# Altium schematic sheet Main.SchDoc
size A
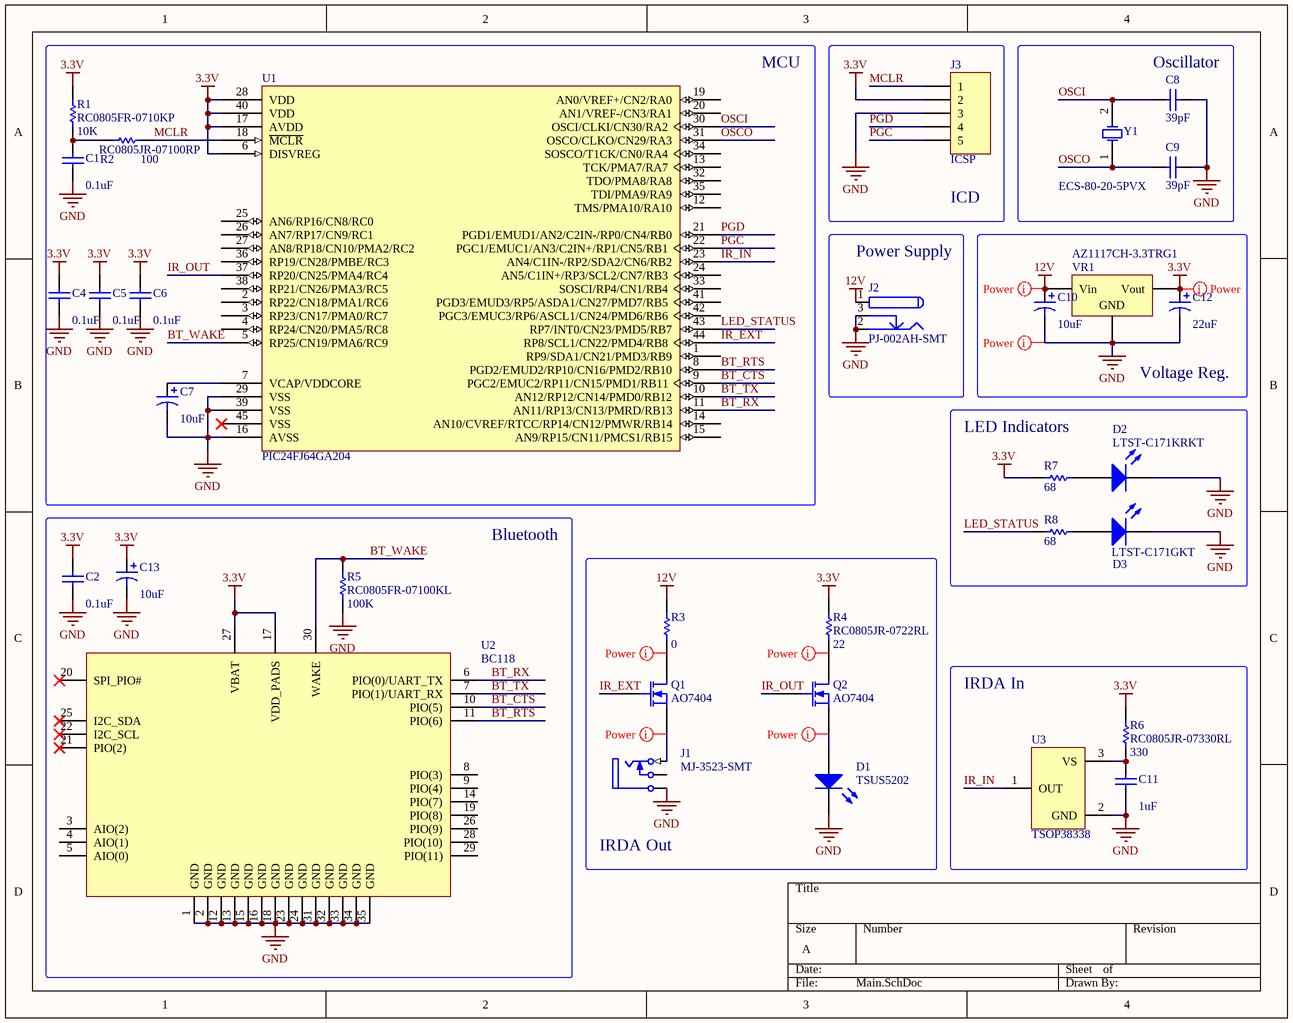
[diagram p0: Main.SchDoc]

## Parts
C1  value 0.1uF  [C0805]  (hidden comment: C0805C104K8RACTU)
C2  value 0.1uF  [C0805]  (hidden comment: C0805C104K8RACTU)
C4  value 0.1uF  [C0805]  (hidden comment: C0805C104K8RACTU)
C5  value 0.1uF  [C0805]  (hidden comment: C0805C104K8RACTU)
C6  value 0.1uF  [C0805]  (hidden comment: C0805C104K8RACTU)
C7  value 10uF  [C0805]  (hidden comment: C0805C106K4PACTU)
C8  value 39pF  [C0805]  (hidden comment: C0805C390J5GACTU)
C9  value 39pF  [C0805]  (hidden comment: C0805C390J5GACTU)
C10  value 10uF  [C0805]  (hidden comment: C0805C106K4PACTU)
C11  value 1uF  [C0805]  (hidden comment: C0805C105K8RACTU)
C12  value 22uF  [C0805]  (hidden comment: C2012X5R1C226K125AC)
C13  value 10uF  [C0805]  (hidden comment: C0805C106K4PACTU)
D1  TSUS5202  [RADIAL-2.54]
D2  LTST-C171KRKT  [6-0805_M]
D3  LTST-C171GKT  [6-0805_M]
J1  MJ-3523-SMT  [MJ-3523]
J2  PJ-002AH-SMT  [PJ-002AH-SMT]
J3  ICSP  [TC2030-MCP-NL]
Q1  AO7404  [SOT323-M]
Q2  AO7404  [SOT323-M]
R1  RC0805FR-0710KP  value 10K  [6-0805_M]
R2  RC0805JR-07100RP  value 100  [6-0805_M]
R3  value 0  [6-0805_M]  (hidden comment: DNP)
R4  RC0805JR-0722RL  value 22  [6-0805_M]
R5  RC0805FR-07100KL  value 100K  [6-0805_M]
R6  RC0805JR-07330RL  value 330  [6-0805_M]
R7  value 68  [6-0805_M]  (hidden comment: RC0805JR-0768RL)
R8  value 68  [6-0805_M]  (hidden comment: RC0805JR-0768RL)
U1  PIC24FJ64GA204  [QFN44_PIC]
U2  BC118  [BC118]
U3  TSOP38338  [TSOP]
VR1  AZ1117CH-3.3TRG1  [SOT223_M]
Y1  ECS-80-20-5PVX  [HC49/US]

## Blocks framed on the sheet
MCU: C1 C4-C7 R1 R2 U1
ICD: J3
Oscillator: C8 C9 Y1
Power Supply: J2
Voltage Reg.: C10 C12 VR1
LED Indicators: D2 D3 R7 R8
Bluetooth: C2 C13 R5 U2
IRDA Out: D1 J1 Q1 Q2 R3 R4
IRDA In: C11 R6 U3

## Nets
3.3V: C2.2 C4.2 C5.2 C6.2 C12.1 C13.1 J3.2 R1.2 R4.2 R6.1 R7.2 U1.6(DISVREG) U1.17(AVDD) U1.28(VDD) U1.40(VDD) U2.17(VDD_PADS) U2.27(VBAT) VR1.3(Vout)
12V: C10.1 J2.1 R3.2 VR1.1(Vin)
GND: C1.1 C2.1 C4.1 C5.1 C6.1 C7.2 C8.2 C9.2 C10.2 C11.1 C12.2 C13.2 D1.2(K) D2.2(K) D3.2(K) J1.5(S) J2.2 J2.3 J3.3 R5.2 U1.16(AVSS) U1.29(VSS) U1.39(VSS) U2.1(GND) U2.2(GND) U2.12(GND) U2.13(GND) U2.15(GND) U2.16(GND) U2.18(GND) U2.23(GND) U2.24(GND) U2.31(GND) U2.32(GND) U2.33(GND) U2.34(GND) U2.35(GND) U3.2(GND) VR1.2(GND)
BT_CTS: U1.9(PGC2/EMUC2/RP11/CN15/PMD1/RB11) U2.10(PIO(5))
BT_RTS: U1.8(PGD2/EMUD2/RP10/CN16/PMD2/RB10) U2.11(PIO(6))
BT_RX: U1.11(AN11/RP13/CN13/PMRD/RB13) U2.6(PIO(0)/UART_TX)
BT_TX: U1.10(AN12/RP12/CN14/PMD0/RB12) U2.7(PIO(1)/UART_RX)
BT_WAKE: R5.1 U1.5(RP25/CN19/PMA6/RC9) U2.30(WAKE)
IR_EXT: Q1.2(G) U1.44(RP8/SCL1/CN22/PMD4/RB8)
IR_IN: U1.23(AN4/C1IN-/RP2/SDA2/CN6/RB2) U3.1(OUT)
IR_OUT: Q2.2(G) U1.37(RP20/CN25/PMA4/RC4)
LED_STATUS: R8.2 U1.43(RP7/INT0/CN23/PMD5/RB7)
MCLR: J3.1 R2.2 U1.18(~{MCLR})
OSCI: C8.1 U1.30(OSCI/CLKI/CN30/RA2) Y1.2(OSC2)
OSCO: C9.1 U1.31(OSCO/CLKO/CN29/RA3) Y1.1(OSC1)
PGC: J3.5 U1.22(PGC1/EMUC1/AN3/C2IN+/RP1/CN5/RB1)
PGD: J3.4 U1.21(PGD1/EMUD1/AN2/C2IN-/RP0/CN4/RB0)
NetC1_2: C1.2 R1.1 R2.1
NetC7_1: C7.1 U1.7(VCAP/VDDCORE)
NetC11_2: C11.2 R6.2 U3.3(VS)
NetD1_1: D1.1(A) Q2.3(S)
NetD2_1: D2.1(A) R7.1
NetD3_1: D3.1(A) R8.1
NetJ1_1: J1.1(T) Q1.3(S)
NetQ1_1: Q1.1(D) R3.1
NetQ2_1: Q2.1(D) R4.1

Not connected (* = marked no-connect by the designer): J1 2(TN); U1 1(RP9/SDA1/CN21/PMD3/RB9) 2(RP22/CN18/PMA1/RC6) 3(RP23/CN17/PMA0/RC7) 4(RP24/CN20/PMA5/RC8) 12(TMS/PMA10/RA10) 13(TCK/PMA7/RA7) 14(AN10/CVREF/RTCC/RP14/CN12/PMWR/RB14) 15(AN9/RP15/CN11/PMCS1/RB15) 19(AN0/VREF+/CN2/RA0) 20(AN1/VREF-/CN3/RA1) 24(AN5/C1IN+/RP3/SCL2/CN7/RB3) 25(AN6/RP16/CN8/RC0) 26(AN7/RP17/CN9/RC1) 27(AN8/RP18/CN10/PMA2/RC2) 32(TDO/PMA8/RA8) 33(SOSCI/RP4/CN1/RB4) 34(SOSCO/T1CK/CN0/RA4) 35(TDI/PMA9/RA9) 36(RP19/CN28/PMBE/RC3) 38(RP21/CN26/PMA3/RC5) 41(PGD3/EMUD3/RP5/ASDA1/CN27/PMD7/RB5) 42(PGC3/EMUC3/RP6/ASCL1/CN24/PMD6/RB6) 45(VSS)*; U2 3(AIO(2)) 4(AIO(1)) 5(AIO(0)) 8(PIO(3)) 9(PIO(4)) 14(PIO(7)) 19(PIO(8)) 20(SPI_PIO#)* 21(PIO(2))* 22(I2C_SCL)* 25(I2C_SDA)* 26(PIO(9)) 28(PIO(10)) 29(PIO(11))

## Layout directives
net class Power: 3.3V, 12V, GND, NetD1_1, NetJ1_1, NetQ1_1, NetQ2_1

## Library data of the parts
C1 C2 C4-C6 = Cap Semi: CAP CER 0.1UF 10V 10% X7R 0805; Published: 8-Jun-2000; LatestRevisionDate: 29-May-2009; LatestRevisionNote: IPC-7351 Footprint Added.; PackageReference: C1206; Publisher: Altium Limited; PackageDescription: Chip Capacitor
C7 C10 C13 = Cap Pol3: CAP CER 10UF 16V 10% X5R 0805; Published: 8-Jun-2000; LatestRevisionDate: 29-May-2009; LatestRevisionNote: IPC-7351 Footprint Added.; PackageReference: C0805; Publisher: Altium Limited; PackageDescription: Chip Capacitor
C8 C9 = Cap Semi: CAP CER 39PF 50V 5% NP0 0805; Published: 8-Jun-2000; LatestRevisionDate: 29-May-2009; LatestRevisionNote: IPC-7351 Footprint Added.; PackageReference: C1206; Publisher: Altium Limited; PackageDescription: Chip Capacitor
C11 = Cap Semi: CAP CER 1UF 10V 10% X7R 080; Published: 8-Jun-2000; LatestRevisionDate: 29-May-2009; LatestRevisionNote: IPC-7351 Footprint Added.; PackageReference: C1206; Publisher: Altium Limited; PackageDescription: Chip Capacitor
C12 = Cap Pol3: CAP CER 22UF 16V 10% X5R 0805; Published: 8-Jun-2000; LatestRevisionDate: 29-May-2009; LatestRevisionNote: IPC-7351 Footprint Added.; PackageReference: C0805; Publisher: Altium Limited; PackageDescription: Chip Capacitor
D1 = LED0: EMITTER IR 950NM 150MA RADIAL; Published: 8-Jun-2000; LatestRevisionDate: 08-Jul-2005; LatestRevisionNote: Mech Layer 1 removed.; PackageReference: LED-0; Publisher: Altium Limited; PackageDescription: LED; 2 Leads
D2 = LED2: LED RED CLEAR THIN 0805 SMD; Published: 8-Jun-2000; LatestRevisionDate: 17-Jul-2002; LatestRevisionNote: Re-released for DXP Platform.; PackageVersion: Feb-2002; PackageReference: 3.2X1.6X1.1; Publisher: Altium Limited; PackageDescription: SM LED; 2 Flat Leads
D3 = LED2: LED GREEN CLEAR THIN 0805 SMD; Published: 8-Jun-2000; LatestRevisionDate: 17-Jul-2002; LatestRevisionNote: Re-released for DXP Platform.; PackageVersion: Feb-2002; PackageReference: 3.2X1.6X1.1; Publisher: Altium Limited; PackageDescription: SM LED; 2 Flat Leads
J1 = Phonejack2 TN: CONN AUDIO JACK MONO 3.5MM SMD; pin to pad: 1>2 2>10 5>1; PackageDocument: 2003; PCB_Layout: Complies with manufacturer's recommendation.; DrillAndSlotSize: Corresponds to nominal value.; LatestRevisionDate: 15-Jul-2004; LatestRevisionNote: Component Replaced & renamed from "Phonejack".; DatasheetDocument: 2003; PackageReference: S1VS_SNB; Publisher: Altium Limited; ComponentLink1Description: Manufacturer Link; ComponentLink1URL: http://www.cliffuk.co.uk/
J2 = PJ-002AH-SMT: Low Voltage Power Supply Connector
Q1 Q2 = MOSFET-N: N-Channel MOSFET; Published: 8-Jun-2000; LatestRevisionDate: 17-Jul-2002; LatestRevisionNote: Re-released for DXP Platform.; PackageVersion: 1995/1996; PackageReference: E3; Publisher: Altium Limited; PackageDescription: TO, Flat Index; 3 In-Line, Axial Leads; Body Dia. 4.6mm; Lead Dia. 0.5 mm (max)
R1 = Res1: RES SMD 10K OHM 5% 1/8W 0805; Published: 8-Jun-2000; LatestRevisionDate: 17-Jul-2002; LatestRevisionNote: Re-released for DXP Platform.; PackageReference: AXIAL-0.3; Publisher: Altium Limited; PackageDescription: Axial Device, Thru-Hole; 2 Leads; 0.3 in Pin Spacing
R2 = Res1: RES SMD 100 OHM 5% 1/8W 0805; Published: 8-Jun-2000; LatestRevisionDate: 17-Jul-2002; LatestRevisionNote: Re-released for DXP Platform.; PackageReference: AXIAL-0.3; Publisher: Altium Limited; PackageDescription: Axial Device, Thru-Hole; 2 Leads; 0.3 in Pin Spacing
R3 = Res1: Published: 8-Jun-2000; LatestRevisionDate: 17-Jul-2002; LatestRevisionNote: Re-released for DXP Platform.; PackageReference: AXIAL-0.3; Publisher: Altium Limited; PackageDescription: Axial Device, Thru-Hole; 2 Leads; 0.3 in Pin Spacing
R4 = Res1: RES SMD 22 OHM 5% 1/8W 0805; Published: 8-Jun-2000; LatestRevisionDate: 17-Jul-2002; LatestRevisionNote: Re-released for DXP Platform.; PackageReference: AXIAL-0.3; Publisher: Altium Limited; PackageDescription: Axial Device, Thru-Hole; 2 Leads; 0.3 in Pin Spacing
R5 = Res1: RES SMD 100K OHM 1% 1/8W 0805; Published: 8-Jun-2000; LatestRevisionDate: 17-Jul-2002; LatestRevisionNote: Re-released for DXP Platform.; PackageReference: AXIAL-0.3; Publisher: Altium Limited; PackageDescription: Axial Device, Thru-Hole; 2 Leads; 0.3 in Pin Spacing
R6 = Res1: RES SMD 330 OHM 5% 1/8W 0805; Published: 8-Jun-2000; LatestRevisionDate: 17-Jul-2002; LatestRevisionNote: Re-released for DXP Platform.; PackageReference: AXIAL-0.3; Publisher: Altium Limited; PackageDescription: Axial Device, Thru-Hole; 2 Leads; 0.3 in Pin Spacing
R7 R8 = Res1: RES SMD 68 OHM 5% 1/8W 0805; Published: 8-Jun-2000; LatestRevisionDate: 17-Jul-2002; LatestRevisionNote: Re-released for DXP Platform.; PackageReference: AXIAL-0.3; Publisher: Altium Limited; PackageDescription: Axial Device, Thru-Hole; 2 Leads; 0.3 in Pin Spacing
U1 = PIC24FJ64GA204: PIC24F 64KB flash, 44QFN MCU; pin to pad: 45>none; Manufacturer: Microchip; Manufacturer Part Number: PIC24FJ64GA204
U2 = BC118: BC118 Bluetooth 4.0 Module
U3 = TSOP38338: IC IR RCVR MOD 38KHZ DOME RADIAL
VR1 = Volt Reg: IC REG LDO 3.3V 0.8A SOT223; pin to pad: 1>3 2>1 3>2; Published: 24-Mar-1999; LatestRevisionDate: 29-May-2009; LatestRevisionNote: IPC-7351 Footprint Added.; PackageReference: D2PAK; Publisher: Altium Limited; PackageDescription: 3-Pin Transistor Outline Package 2.54 mm Pitch, 15.1 mm Lead Span
Y1 = XTAL: CRYSTAL 8.0000MHZ 20PF SMD; Published: 8-Jun-2000; LatestRevisionDate: 17-Jul-2002; LatestRevisionNote: Re-released for DXP Platform.; PackageReference: R38; Publisher: Altium Limited; PackageDescription: Crystal, Thru-Hole; 2 Leads; Body 3.1 x 8.2 mm (Dia.xH)